# EAGLE design b3 bart - rev00 (EAGLE 9.5.2)
COMPANY: ADAFRUIT INDUSTRIES; DRAWN: KTOWN; REV: B
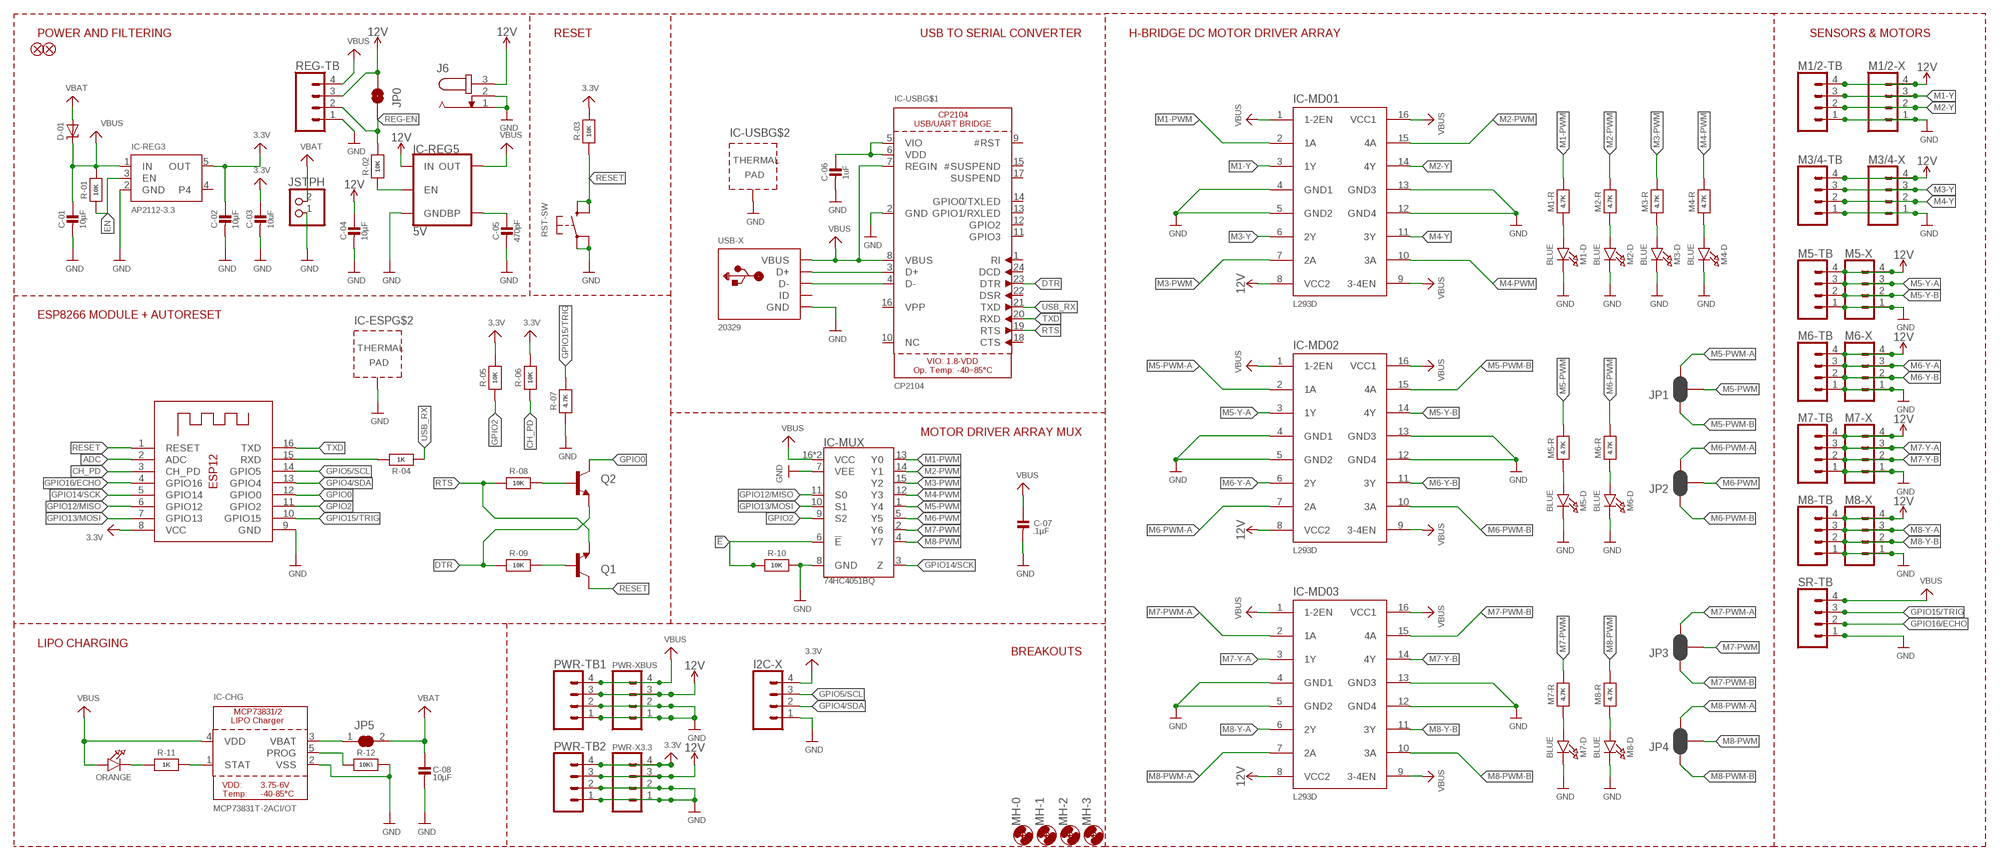
[diagram p0: schematic, sheet 1]

## Parts
C-01  10µF  CAP_CERAMIC0805-NOOUTLINE  [0805-NO]
C-02  10µF  CAP_CERAMIC0805-NOOUTLINE  [0805-NO]
C-03  10uF  CAP_CERAMIC0805-NOOUTLINE  [0805-NO]
C-04  10µF  CAP_CERAMIC0805-NOOUTLINE  [0805-NO]
C-05  470pF  CAP_CERAMIC0805-NOOUTLINE  [0805-NO]
C-06  1uF  CAP_CERAMIC0603_NO  [0603-NO@1]
C-07  .1µF  CAP_CERAMIC0805-NOOUTLINE  [0805-NO]
C-08  10µF  CAP_CERAMIC0805-NOOUTLINE  [0805-NO]
CHG-D  ORANGE  LED0805_NOOUTLINE  [CHIPLED_0805_NOOUTLINE]
D-01  MBR120  DIODE-SCHOTTKYSOD-123  [SOD-123]
FD1  FIDUCIAL1X2  [FIDUCIAL-1X2]
FD2  FIDUCIAL1X2  [FIDUCIAL-1X2]
I2C-X  CONN_04LONGPADS  [1X04_LONGPADS]
IC-CHG  MCP73831T-2ACI/OT  MCP73831/2  [SOT23-5]
IC-ESP  ESP-12  ESP-12S  [ESP-12S]
IC-MD01  L293D  [DIL16]
IC-MD02  L293D  [DIL16]
IC-MD03  L293D  [DIL16]
IC-MUX  74HC4051BQ  [DHVQFN-16-2.5X3.5MM]
IC-REG3  AP2112-3.3  VREG_SOT23-5  [SOT23-5]
IC-REG5  5V  V_REG_MIC52055V  [SOT23-5]
IC-USB  CP2104  [QFN24_4MM_SMSC]
J6  JACK-PLUG1  [SPC4078]
JP0  JUMPER-SMT_2_NO_SILK  [SMT-JUMPER_2_NO_SILK]
JP1  JUMPER-SMT_3_2-NC_PASTE_SILK  [SMT-JUMPER_3_2-NC_PASTE_SILK]
JP2  JUMPER-SMT_3_2-NC_PASTE_SILK  [SMT-JUMPER_3_2-NC_PASTE_SILK]
JP3  JUMPER-SMT_3_2-NC_PASTE_SILK  [SMT-JUMPER_3_2-NC_PASTE_SILK]
JP4  JUMPER-SMT_3_2-NC_PASTE_SILK  [SMT-JUMPER_3_2-NC_PASTE_SILK]
JP5  SOLDERJUMPER_CLOSED  [SOLDERJUMPER_CLOSEDWIRE]
M1-D  BLUE  LED0805_NOOUTLINE  [CHIPLED_0805_NOOUTLINE]
M1-R  4.7K  RESISTOR_0603_NOOUT  [0603-NO]
M1/2-TB  CONN_04SCREW  [SCREWTERMINAL-3.5MM-4]
M1/2-X  CONN_04LONGPADS  [1X04_LONGPADS]
M2-D  BLUE  LED0805_NOOUTLINE  [CHIPLED_0805_NOOUTLINE]
M2-R  4.7K  RESISTOR_0603_NOOUT  [0603-NO]
M3-D  BLUE  LED0805_NOOUTLINE  [CHIPLED_0805_NOOUTLINE]
M3-R  4.7K  RESISTOR_0603_NOOUT  [0603-NO]
M3/4-TB  CONN_04SCREW  [SCREWTERMINAL-3.5MM-4]
M3/4-X  CONN_04LONGPADS  [1X04_LONGPADS]
M4-D  BLUE  LED0805_NOOUTLINE  [CHIPLED_0805_NOOUTLINE]
M4-R  4.7K  RESISTOR_0603_NOOUT  [0603-NO]
M5-D  BLUE  LED0805_NOOUTLINE  [CHIPLED_0805_NOOUTLINE]
M5-R  4.7K  RESISTOR_0603_NOOUT  [0603-NO]
M5-TB  CONN_04SCREW  [SCREWTERMINAL-3.5MM-4]
M5-X  CONN_04LONGPADS  [1X04_LONGPADS]
M6-D  BLUE  LED0805_NOOUTLINE  [CHIPLED_0805_NOOUTLINE]
M6-R  4.7K  RESISTOR_0603_NOOUT  [0603-NO]
M6-TB  CONN_04SCREW  [SCREWTERMINAL-3.5MM-4]
M6-X  CONN_04LONGPADS  [1X04_LONGPADS]
M7-D  BLUE  LED0805_NOOUTLINE  [CHIPLED_0805_NOOUTLINE]
M7-R  4.7K  RESISTOR_0603_NOOUT  [0603-NO]
M7-TB  CONN_04SCREW  [SCREWTERMINAL-3.5MM-4]
M7-X  CONN_04LONGPADS  [1X04_LONGPADS]
M8-D  BLUE  LED0805_NOOUTLINE  [CHIPLED_0805_NOOUTLINE]
M8-R  4.7K  RESISTOR_0603_NOOUT  [0603-NO]
M8-TB  CONN_04SCREW  [SCREWTERMINAL-3.5MM-4]
M8-X  CONN_04LONGPADS  [1X04_LONGPADS]
MH-0  MOUNT-HOLE3.0  [3,0]
MH-1  MOUNT-HOLE3.0  [3,0]
MH-2  MOUNT-HOLE3.0  [3,0]
MH-3  MOUNT-HOLE3.0  [3,0]
PWR-TB1  CONN_04SCREW  [SCREWTERMINAL-3.5MM-4]
PWR-TB2  CONN_04SCREW  [SCREWTERMINAL-3.5MM-4]
PWR-X3.3  CONN_04LONGPADS  [1X04_LONGPADS]
PWR-XBUS  CONN_04LONGPADS  [1X04_LONGPADS]
Q1  mmbt2222  TRANSISTOR_NPNSOT23-3  [SOT23-3]
Q2  mmbt2222  TRANSISTOR_NPNSOT23-3  [SOT23-3]
R-01  10K  RESISTOR_0603_NOOUT  [0603-NO]
R-02  10K  RESISTOR_0603_NOOUT  [0603-NO]
R-03  10K  RESISTOR_0603_NOOUT  [0603-NO]
R-04  1K  RESISTOR_0603MP  [_0603MP]
R-05  10K  RESISTOR_0603_NOOUT  [0603-NO]
R-06  10K  RESISTOR_0603_NOOUT  [0603-NO]
R-07  4.7K  RESISTOR_0603_NOOUT  [0603-NO]
R-08  10K  RESISTOR_0603_NOOUT  [0603-NO]
R-09  10K  RESISTOR_0603_NOOUT  [0603-NO]
R-10  10K  RESISTOR_0603_NOOUT  [0603-NO]
R-11  1K  RESISTOR_0603_NOOUT  [0603-NO]
R-12  10K\  RESISTOR_0603_NOOUT  [0603-NO]
REG-TB  CONN_04SCREW  [SCREWTERMINAL-3.5MM-4]
RST-SW  KMR2  SWITCH_TACT_SMT4.6X2.8  [BTN_KMR2_4.6X2.8]
SR-TB  CONN_04SCREW  [SCREWTERMINAL-3.5MM-4]
USB-X  20329  USB_MICRO_20329_V2  [4UCONN_20329_V2]
X1  JSTPH  CON_JST_PH_2PIN  [JSTPH2]

## Nets
3.3V: C-02.1 C-03.1 I2C-X.4 IC-ESP.8(VCC) IC-REG3.5(OUT) PWR-TB2.4 PWR-X3.3.4 R-03.2 R-05.2 R-06.2
12V [power-motors]: C-04.1 IC-MD01.8(VCC2) IC-MD02.8(VCC2) IC-MD03.8(VCC2) IC-REG5.1(IN) J6.3 JP0.2 M1/2-TB.4 M1/2-X.4 M3/4-TB.4 M3/4-X.4 M5-TB.4 M5-X.4 M6-TB.4 M6-X.4 M7-TB.4 M7-X.4 M8-TB.4 M8-X.4 PWR-TB1.3 PWR-TB2.3 PWR-X3.3.3 PWR-XBUS.3 REG-TB.3
!E!: IC-MUX.6(!E!) R-10.1
ADC: IC-ESP.2(ADC)
CH_PD: IC-ESP.3(CH_PD) R-06.1
D+: IC-USB.3(D+) USB-X.D+
D-: IC-USB.4(D-) USB-X.D-
DTR: IC-USB.23(DTR) Q2.2(E) R-09.1
EN: IC-REG3.3(EN) R-01.1
GND: C-01.2 C-02.2 C-03.2 C-04.2 C-05.2 C-06.2 C-07.2 C-08.2 I2C-X.1 IC-CHG.2(VSS) IC-ESP.9(GND) IC-ESP.P$1(TP) IC-MD01.4(GND1) IC-MD01.5(GND2) IC-MD01.12(GND4) IC-MD01.13(GND3) IC-MD02.4(GND1) IC-MD02.5(GND2) IC-MD02.12(GND4) IC-MD02.13(GND3) IC-MD03.4(GND1) IC-MD03.5(GND2) IC-MD03.12(GND4) IC-MD03.13(GND3) IC-MUX.7(VEE) IC-MUX.8(GND) IC-REG3.2(GND) IC-REG5.2(GND) IC-USB.2(GND) IC-USB.THERM(TP) J6.1 J6.2 M1-D.C M1/2-TB.1 M1/2-X.1 M2-D.C M3-D.C M3/4-TB.1 M3/4-X.1 M4-D.C M5-D.C M5-TB.1 M5-X.1 M6-D.C M6-TB.1 M6-X.1 M7-D.C M7-TB.1 M7-X.1 M8-D.C M8-TB.1 M8-X.1 PWR-TB1.1 PWR-TB1.2 PWR-TB2.1 PWR-TB2.2 PWR-X3.3.1 PWR-X3.3.2 PWR-XBUS.1 PWR-XBUS.2 R-07.1 R-10.2 R-12.2 REG-TB.1 RST-SW.A'(P1) RST-SW.A(P) SR-TB.1 USB-X.BASE@1(GND) USB-X.BASE@2(GND) USB-X.GND USB-X.SPRT@1(GND) USB-X.SPRT@2(GND) USB-X.SPRT@3(GND) USB-X.SPRT@4(GND) X1.1
GPIO0: IC-ESP.12(GPIO0) Q2.3(C)
GPIO2: IC-ESP.11(GPIO2) IC-MUX.9(S2) R-05.1
GPIO4/SDA: I2C-X.2 IC-ESP.13(GPIO4)
GPIO5/SCL: I2C-X.3 IC-ESP.14(GPIO5)
GPIO12/MISO: IC-ESP.6(GPIO12) IC-MUX.11(S0)
GPIO13/MOSI: IC-ESP.7(GPIO13) IC-MUX.10(S1)
GPIO14/SCK: IC-ESP.5(GPIO14) IC-MUX.3(Z)
GPIO15/TRIG: IC-ESP.10(GPIO15) R-07.2 SR-TB.3
GPIO16/ECHO: IC-ESP.4(GPIO16) SR-TB.2
M1-PWM: IC-MD01.2(1A) IC-MUX.13(Y0) M1-R.2
M1-Y [power-motors]: IC-MD01.3(1Y) M1/2-TB.3 M1/2-X.3
M2-PWM: IC-MD01.15(4A) IC-MUX.14(Y1) M2-R.2
M2-Y [power-motors]: IC-MD01.14(4Y) M1/2-TB.2 M1/2-X.2
M3-PWM: IC-MD01.7(2A) IC-MUX.15(Y2) M3-R.2
M3-Y [power-motors]: IC-MD01.6(2Y) M3/4-TB.3 M3/4-X.3
M4-PWM: IC-MD01.10(3A) IC-MUX.12(Y3) M4-R.2
M4-Y [power-motors]: IC-MD01.11(3Y) M3/4-TB.2 M3/4-X.2
M5-PWM: IC-MUX.1(Y4) JP1.2 M5-R.2
M5-PWM-A: IC-MD02.2(1A) JP1.3
M5-PWM-B: IC-MD02.15(4A) JP1.1
M5-Y-A [power-motors]: IC-MD02.3(1Y) M5-TB.3 M5-X.3
M5-Y-B [power-motors]: IC-MD02.14(4Y) M5-TB.2 M5-X.2
M6-PWM: IC-MUX.5(Y5) JP2.2 M6-R.2
M6-PWM-A: IC-MD02.7(2A) JP2.3
M6-PWM-B: IC-MD02.10(3A) JP2.1
M6-Y-A: IC-MD02.6(2Y) M6-TB.3 M6-X.3
M6-Y-B: IC-MD02.11(3Y) M6-TB.2 M6-X.2
M7-PWM: IC-MUX.2(Y6) JP3.2 M7-R.2
M7-PWM-A: IC-MD03.2(1A) JP3.3
M7-PWM-B: IC-MD03.15(4A) JP3.1
M7-Y-A: IC-MD03.3(1Y) M7-TB.3 M7-X.3
M7-Y-B: IC-MD03.14(4Y) M7-TB.2 M7-X.2
M8-PWM: IC-MUX.4(Y7) JP4.2 M8-R.2
M8-PWM-A: IC-MD03.7(2A) JP4.3
M8-PWM-B: IC-MD03.10(3A) JP4.1
M8-Y-A [power-motors]: IC-MD03.6(2Y) M8-TB.3 M8-X.3
M8-Y-B [power-motors]: IC-MD03.11(3Y) M8-TB.2 M8-X.2
N$1: CHG-D.C R-11.1
N$2: M5-D.A M5-R.1
N$3: IC-CHG.1(STAT) R-11.2
N$4: IC-CHG.5(PROG) R-12.1
N$5: M6-D.A M6-R.1
N$6: M1-D.A M1-R.1
N$7: IC-CHG.3(VBAT) JP5.1
N$8: C-06.1 IC-USB.5(VIO) IC-USB.6(VDD)
N$9: M2-D.A M2-R.1
N$10: IC-REG5.3(EN) R-02.1
N$11: M7-D.A M7-R.1
N$12: Q1.1(B) R-09.2
N$13: Q2.1(B) R-08.2
N$15: M8-D.A M8-R.1
N$18: M3-D.A M3-R.1
N$19: M4-D.A M4-R.1
N$21: C-05.1 IC-REG5.4(BP)
REG-EN: JP0.1 R-02.2 REG-TB.2
RESET: IC-ESP.1(RESET) Q1.3(C) R-03.1 RST-SW.B'(S1) RST-SW.B(S)
RTS: IC-USB.19(RTS) Q1.2(E) R-08.1
RXD: IC-ESP.15(RXD) R-04.2
TXD: IC-ESP.16(TXD) IC-USB.20(RXD)
USB_RX: IC-USB.21(TXD) R-04.1
VBAT: C-08.1 D-01.A JP5.2 X1.2
VBUS: C-01.1 C-07.1 CHG-D.A D-01.C IC-CHG.4(VDD) IC-MD01.1(1-2EN) IC-MD01.9(3-4EN) IC-MD01.16(VCC1) IC-MD02.1(1-2EN) IC-MD02.9(3-4EN) IC-MD02.16(VCC1) IC-MD03.1(1-2EN) IC-MD03.9(3-4EN) IC-MD03.16(VCC1) IC-MUX.16(VCC) IC-MUX.EP(VCC) IC-REG3.1(IN) IC-REG5.5(OUT) IC-USB.7(REGIN) IC-USB.8(VBUS) PWR-TB1.4 PWR-XBUS.4 R-01.2 REG-TB.4 SR-TB.4 USB-X.VBUS
Unconnected: IC-REG3.4 IC-USB.1(RI) IC-USB.9(#RST) IC-USB.10(NC) IC-USB.11(GPIO3) IC-USB.12(GPIO2) IC-USB.13(GPIO1/RXLED) IC-USB.14(GPIO0/TXLED) IC-USB.15(#SUSPEND) IC-USB.16(VPP) IC-USB.17(SUSPEND) IC-USB.18(CTS) IC-USB.22(DSR) IC-USB.24(DCD) USB-X.ID

## Notes on the sheet
- POWER AND FILTERING | RESET | USB TO SERIAL CONVERTER | H-BRIDGE DC MOTOR DRIVER ARRAY | SENSORS & MOTORS
- ESP8266 MODULE + AUTORESET
- MOTOR DRIVER ARRAY MUX
- LIPO CHARGING | BREAKOUTS

## Library data of the parts
C-01-C-08 = microbuilder:CAP_CERAMIC: Ceramic Capacitors For new designs, use the packages preceded by an '_' character since they are more reliable: The following footprints should be used on most boards: _0402 - Standard footprint for regular board layouts _0603 - Standard footprint for regular board layouts _0805 - Standard footprint for regular board layouts _1206 - Standard footprint for regular board layouts For extremely tight-pitch boards where space is at a premium, the following 'micro-pitch' footprints can be used (smaller pads, no silkscreen outline, etc.): _0402MP - Micro-pitch footprint for very dense/compact boards _0603MP - Micro-pitch footprint for very dense/compact boards _0805MP - Micro-pitch footprint for very dense/compact boards _1206MP - Micro-pitch footprint for very dense/compact boards
CHG-D M1-D M2-D M3-D M4-D M5-D M6-D M7-D M8-D = microbuilder:LED: LED 0603 - 0603 Surface Mount Package 2mA: Green LED - Low Power (3.9mcd, 2ma, 1.7Vf) - Digikey: 475-2709-2-ND Orange LED - Low Power (9.8mcd, 2ma, 1.8Vf) - Digikey: 475-1194-2-ND Red LED - Low Power (5mcd, 2ma, 1.8Vf) - Digikey: 475-1195-2-ND Yellow LED - Low Power (7mcd, 2ma, 1.8Vf) - Digikey: 475-1196-2-ND 5mA: Blue LED - Low Power (17mcd, 5ma, 2.9Vf) - Digikey: LNJ937W8CRACT-ND 0805 - 0805 Surface Mount Package 2mA: Red LED (8.8mcd, 2mA, 1.8Vf, Clear) - Low Power [Digikey: 475-2510-1-ND] Green LED (5mcd, 2mA, 1.8Vf, Clear) - Low Power [Digikey: 475-2730-1-ND] Yellow LED (11.3mcd, 2mA, 1.8Vf, Clear) - Low Power [Digikey: 475-2555-1-ND] 20mA: Red LED (104mcd, 20mA, Diffused) - LS R976 [Digikey: 475-1278-6-ND] Red LED (12mcd, 20mA, 2.0Vf, Clear) - APT2012EC [Digikey: 754-1128-1-ND] Green LED (15mcd, 20mA, 2.2Vf, Clear) - APT2012GC [Digikey: 754-1131-1-ND] Orange LED (160mcd, 20mA, 2.1Vf, Clear) - APT2012SECK [Digikey: 754-1130-1-ND] 1206 - 1206 Surface Mount Package Green LED (26mcd, 20mA, Diffused) - LG N971 [Digikey: 475-1407-6-ND] Red LED (15mcd, 20mA, Diffused) - LH N974 [Digikey: 475-1416-6-ND] Cree - Cree High-Power Surface Mount LEDs XPEBWT-L1-0000-00D50 - White 111lm 350mA 2.9Vf 6200K 110° XTEAWT-00-0000-00000LEE3 - White 114lm 350mA 2.85Vf 5000K 115° Everlight - Everlight 45-21 Series Surface Mount LEDs 45-21/QK2C-B2832AC2CB2/2T - Warm White 2000mcd 20mA 3.25Vf 3050K 120° 45-21/LK2C-B38452C4CB2/2T - Nuetral White 2000mcd 20mA 3.25Vf 4150K 120° 45-21/LK2C-B50634C6CB2/2T - Cold White 2200mcd 20mA 3.25Vf 5650K 120° PLCC2 Reverse Mount LS T77K-J1L2-1-0-2-R18-Z - Red 11.25mcd 2mA 1.8Vf 630nm 120° LO T77K-L1M2-24-Z - Orange 19.6mcd 2mA 1.8Vf 606nm 120° LY T77K-K2M1-26-Z - Yellow 15.7mcd 2mA 1.8Vf 587nm 120°
D-01 = microbuilder:DIODE-SCHOTTKY
FD1 FD2 = SparkFun-Aesthetics:FIDUCIAL: Fiducial Alignment Points Point-of-reference for pick-and-place machines and other optical instruments.
I2C-X M1/2-X M3/4-X M5-X M6-X M7-X M8-X PWR-X3.3 PWR-XBUS = SparkFun-Connectors:CONN_04: Multi connection point. Often used as Generic Header-pin footprint for 0.1 inch spaced/style header connections On any of the 0.1 inch spaced packages, you can populate with these: Break Away Headers - Straight <https://www.sparkfun.com/products/116> (PRT-00116) Break Away Male Headers - Right Angle <https://www.sparkfun.com/products/553> (PRT-00553) Female Headers <https://www.sparkfun.com/products/115> (PRT-00115) Break Away Headers - Machine Pin <https://www.sparkfun.com/products/117> (PRT-00117) Break Away Female Headers - Swiss Machine Pin <https://www.sparkfun.com/products/743> (PRT-00743) For SCREWTERMINALS and SPRING TERMINALS visit here: Screw Terimnals on SparkFun.com <https://www.sparkfun.com/search/results?term=Screw+Terminals> (5mm/3.5mm/2.54mm spacing) This device is also useful as a general connection point to wire up your design to another part of your project. Our various solder wires solder well into these plated through hole pads. Hook-Up Wire - Assortment (Stranded, 22 AWG) <https://www.sparkfun.com/products/11375> (PRT-11375) Hook-Up Wire - Assortment (Solid Core, 22 AWG) <https://www.sparkfun.com/products/11367> (PRT-11367) View the entire wire category on our website here <https://www.sparkfun.com/categories/141> Special notes: Molex polarized connector foot print use with SKU : PRT-08231 with associated crimp pins and housings. 1MM SMD Version SKU: PRT-10208; PROD_ID: CONN-09696
IC-CHG = microbuilder:MCP73831/2: MCP73831/2 LIPO Charger VDD: 3.75 - 6V Temp -40 - 85°C Programmable Charge Rate: 15-500mA NOTE: STAT is a tri-state logic output on the MCP73831 and an open-drain output on the MCP73832. SOT23-5 with 4.2V output and tri-state logic on STAT = MCP73831T-2ACI/OT
IC-ESP = microbuilder:ESP-12S
IC-MD01-IC-MD03 = st-microelectronics:L293D: PUSH-PULL 4 CHANNEL DRIVER; MPN: L293D; OC_FARNELL: 9589619; OC_NEWARK: 56P8249
IC-MUX = 8mux:74HC4051: NXP 74HC4051 8-Channel Analog Multiplexer/Demultiplexer The 74HC4051; 74HCT4051 is a single-pole octal-throw analog switch (SP8T) suitable for use in analog or digital 8:1 multiplexer/demultiplexer applications. The switch features three digital select inputs (S0, S1 and S2), eight independent inputs/outputs (Yn), a common input/output (Z) and a digital enable input (E). When E is HIGH, the switches are turned off. Inputs include clamp diodes. This enables the use of current limiting resistors to interface inputs to voltages in excess of VCC. Datasheet <http://www.nxp.com/documents/data_sheet/74HC_HCT4051.pdf>; PROD_ID: IC-13334
IC-REG3 = microbuilder:VREG_SOT23-5: SOT23-5 Fixed Voltage Regulators Part Current Out V Out V In V Dropout θJA (°C/W) TJ (°C) Digikey Part No. ADP121 150mA 3.3V 3.4-5.5V 0.09V @ 150mA -- -- ADP121-AUJZ33R7CT-ND ADP121 150mA 3.0V 3.1-5.5V 0.09V @ 150mA -- -- ADP121-AUJZ30R7CT-ND ADP122 300mA 3.3V 3.4-5.5V 0.085V @ 300mA -- -- ADP122AUJZ-3.3-R7CT-ND ADP1712 300mA 3.3V 3.5-5.5V 0.17V @ 300mA -- -- ADP1712AUJZ-3.3-R7TR-ND AP7311 (Low Cost) 150mA 3.3V 3.5-6V 0.15V @ 150mA -- -- AP7311-33WG-7DICT-ND LD39015M18R 150mA 1.8V 1.9V-5.5V 0.08V @ 100mA -- -- 497-6977-1-ND LP2985A-33DBVR 150mA 3.3V 3.3-16V 0.28V @ 150mA 206 150 296-18479-1-ND MCP1824T-3302E/OT 300mA 3.3V 3.5V-6V 0.2V @ 300mA -- -- MCP1824T-3302E/OTCT-ND MIC5205-2.5YM5 TR 150mA 2.5V 2.7-16V 0.165V @ 150mA -- -- 576-1257-2-ND MIC5205-3.0YM5 TR 150mA 3.0V 3.2V-16V 0.165V @ 150mA -- -- 576-1258-2-ND MIC5205-3.3YM5 TR 150mA 3.3V 3.5V-16V 0.165V @ 150mA -- -- 576-1259-2-ND TPS780330220 150mA 3.3V+2.2V 3.6-5.5V 250mV Max -- -- 296-23332-1-ND TDA3663/N1,135 100mA 3.3V 3.5-45V 0.18V @ 50mA -- -- 568-5343-1-ND Max operating temp can be calculated using θJA, TJ (max junction temperature), and power in watts. Set the "Maximum Ambient Temperature" until it reaches TJ ("Max Junction Temperature"), which is the absolute limit for safe use of the regulator: Heat Sink Temperature Calculator <http://www.daycounter.com/Calculators/Heat-Sink-Temperature-Calculator.phtml> For example, With 12V source into a 3.3V LP2985 and a 30mA load, we are dissipating (12V-3.3V) * 0.03A = 0.261W. With a θJA of 206 °C/W, a TJ of 150°C, and 261mW we can safely use the chip without a heat sink up to 75°C (=147.1°C Junction Temperature).
IC-REG5 = SparkFun-IC-Power:V_REG_MIC5205: V_REG MIC5205 Standard 3.3V, 5V, and Adjustable 150mA LDO voltage regulator in SOT-23 layout. Micrel part MIC5205. BP (by-pass) pin is used to lower output noise with 470pF cap, may be left open. On the adjustable version BP is used to set output.; PROD_ID: VREG-00823
IC-USB = microbuilder:CP2104: CP2104 - USB to UART Bridge VDD Output: 3.45V
J6 = con-jack:JACK-PLUG: DC POWER JACK Power Jack, DC, Right Angle, Through Hole, Rated 5A at 16VDC, PC Terminals Distributor: Farnell (www.Farnell.de) Drawing: 84N1161.pdf / 84N1162.pdf Manufacturer: SPC Technology (www.spctechnology.com) Type: SPC4077 / SPC 4078; OC_FARNELL: unknown; OC_NEWARK: unknown
JP0 = SparkFun-Jumpers:JUMPER-SMT_2_NO: Normally open jumper This jumper has two pads in close proximity to each other. Apply solder to close the connection. Round pads are easier to solder for beginners, but are a lot larger. SparkFun Product that uses the round pads: SparkFun EL Sequencer <https://www.sparkfun.com/products/12781>
JP1-JP4 = SparkFun-Jumpers:JUMPER-SMT_3_2-NC_PASTE: Normally closed solder jumper (2 of 2 connections) This jumper has an aperture in the stencil to allow solder paste to bridge both connections. Both connections are normally closed (NC). Wick off the solder to open the connection(s). Reapply solder to reclose the connection(s).
JP5 = microbuilder:SOLDERJUMPER_CLOSED: Solder Jumper - Closed These solder jumpers are closed by default CLOSEDWIRE - 10 mil trace between pads that can be cut and resoldered later CLOSEDPERM - 63 mil trace between pads for a permanent connection (used to 'bridge' two signals, a shameless hack for Eagle). Can double as a test point as well (no cream layer)
M1-R M2-R M3-R M4-R M5-R M6-R M7-R M8-R R-01-R-09 R-10-R-12 = microbuilder:RESISTOR: Resistors For new designs, use the packages preceded by an '_' character since they are more reliable: The following footprints should be used on most boards: _0402 - Standard footprint for regular board layouts _0603 - Standard footprint for regular board layouts _0805 - Standard footprint for regular board layouts _1206 - Standard footprint for regular board layouts For extremely tight-pitch boards where space is at a premium, the following 'micro-pitch' footprints can be used (smaller pads, no silkscreen outline, etc.): _0402MP - Micro-pitch footprint for very dense/compact boards _0603MP - Micro-pitch footprint for very dense/compact boards _0805MP - Micro-pitch footprint for very dense/compact boards _1206MP - Micro-pitch footprint for very dense/compact boards
M1/2-TB M3/4-TB M5-TB M6-TB M7-TB M8-TB PWR-TB1 PWR-TB2 REG-TB SR-TB = SparkFun-Connectors:CONN_04: Multi connection point. Often used as Generic Header-pin footprint for 0.1 inch spaced/style header connections On any of the 0.1 inch spaced packages, you can populate with these: Break Away Headers - Straight <https://www.sparkfun.com/products/116> (PRT-00116) Break Away Male Headers - Right Angle <https://www.sparkfun.com/products/553> (PRT-00553) Female Headers <https://www.sparkfun.com/products/115> (PRT-00115) Break Away Headers - Machine Pin <https://www.sparkfun.com/products/117> (PRT-00117) Break Away Female Headers - Swiss Machine Pin <https://www.sparkfun.com/products/743> (PRT-00743) For SCREWTERMINALS and SPRING TERMINALS visit here: Screw Terimnals on SparkFun.com <https://www.sparkfun.com/search/results?term=Screw+Terminals> (5mm/3.5mm/2.54mm spacing) This device is also useful as a general connection point to wire up your design to another part of your project. Our various solder wires solder well into these plated through hole pads. Hook-Up Wire - Assortment (Stranded, 22 AWG) <https://www.sparkfun.com/products/11375> (PRT-11375) Hook-Up Wire - Assortment (Solid Core, 22 AWG) <https://www.sparkfun.com/products/11367> (PRT-11367) View the entire wire category on our website here <https://www.sparkfun.com/categories/141> Special notes: Molex polarized connector foot print use with SKU : PRT-08231 with associated crimp pins and housings. 1MM SMD Version SKU: PRT-10208; PROD_ID: 2xCONN-08399; SF_ID: 2xPRT-08084
MH-0 MH-1-MH-3 = holes:MOUNT-HOLE: MOUNTING HOLE with drill center marker
Q1 Q2 = SparkFun:TRANSISTOR_NPN: Transistor NPN BJT configuration in SOT23 package. MMBT2222 is the common NPN we use. Double check BCE configuration again layout.
RST-SW = microbuilder:SWITCH_TACT_SMT: SMT Tact Switches 6x6mm - Digikey: P12940SCT-ND KMR2 (4.6x2.8mm) - Digikey: 401-1426-1-ND EVQ-PQHB55 - Light Touch, 160GF (4.5x4.5mm) - Digikey: P8090SCT-ND KMT0 - KMT021 NGJ LHS (etc.) IP68/Waterproof - Digikey: CKN10289CT-ND
USB-X = microbuilder:USB: USB Connectors USBMINIB - Surface Mount Female Mini-B USB Connector 4UConnector: 06564
X1 = microbuilder:CON_JST_PH_2PIN: JST 2-Pin Right-Angle Connector PH-Series - 4UConnector: 17311 SH-Series - 4UConnector: 07278

## Net classes
0 default: width 0.254 mm, drill 0.406 mm, clearance 0.203 mm
2 power-motors: width 0.457 mm, drill 0.406 mm, clearance 0.305 mm

## Board
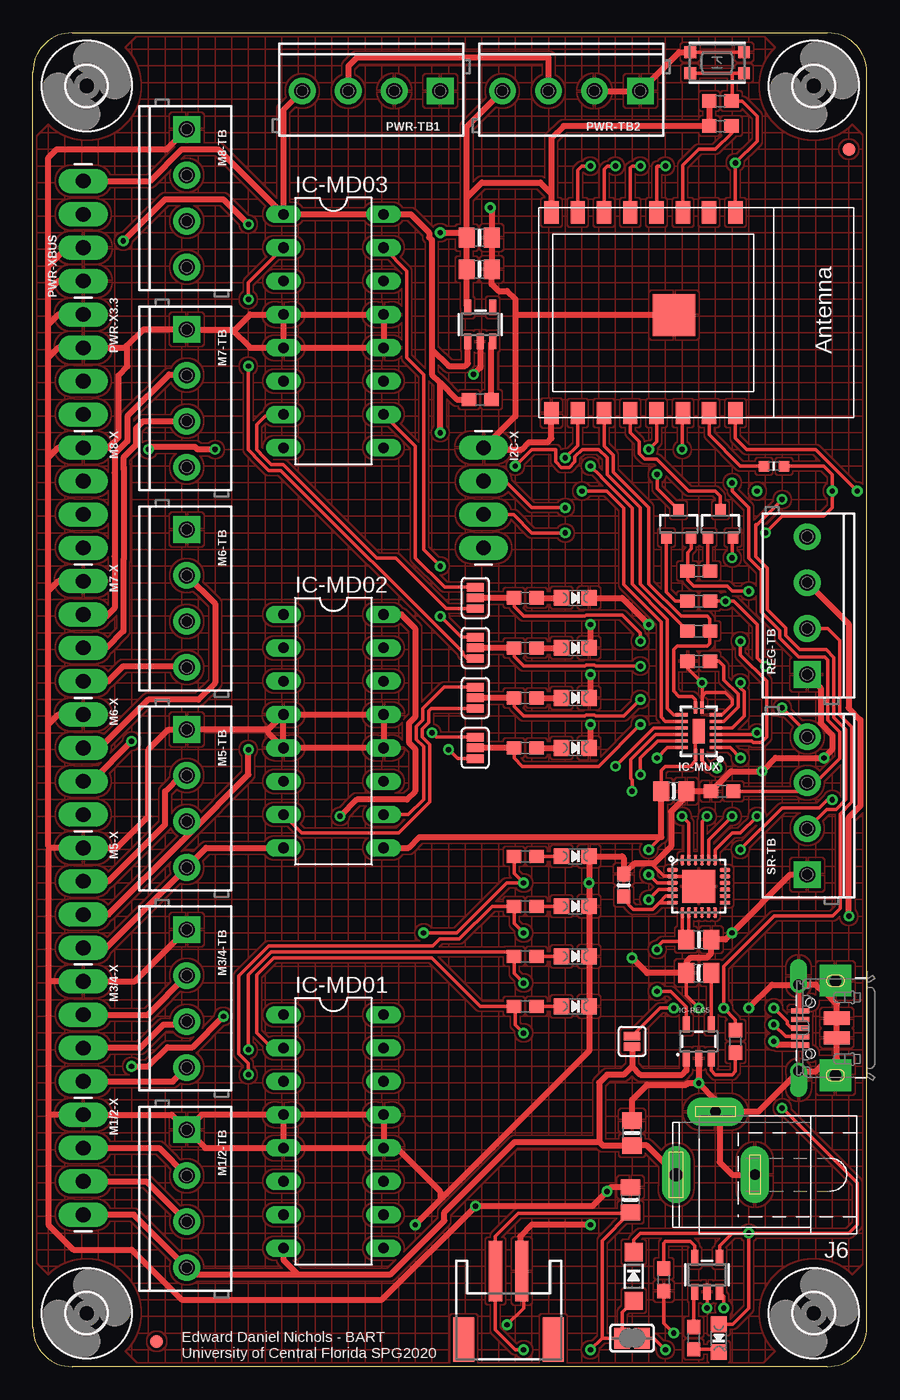
[diagram p1: board, top side]
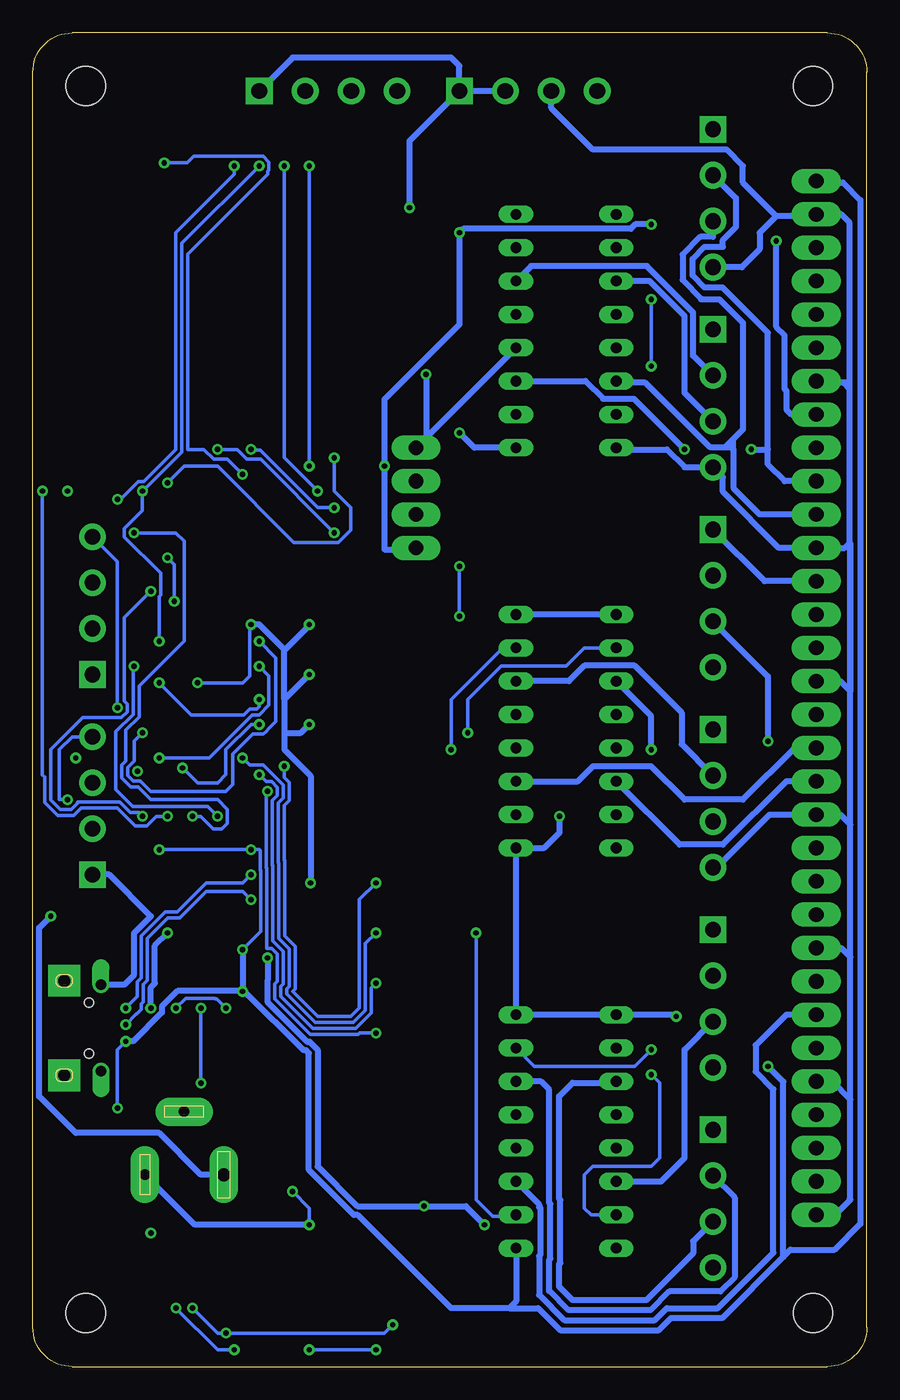
[diagram p2: board, bottom side, seen from below]

Size 63.5 x 101.6 mm. Coordinates in mm from the lower left corner, seen from the top.
Outline: 60.5,0 3,0 arc-90 0,3 0,98.6 arc-90 3,101.6 60.5,101.6 arc-90 63.5,98.6 63.5,3 arc-90 60.5,0
Copper layers (1*16): Top 0.035mm / dielectric 1.5mm / Bottom 0.035mm
Design rules "adafruit *": minimum track width 8mil, minimum drill 15.5mil, track to track 8mil, track to pad 8mil, pad to pad 8mil, via to via 8mil, smd to smd 8mil, copper to edge 10mil, drill to drill 8mil, minimum pad ring 10mil, minimum via ring 8mil, stop-mask expansion 2mil, vias tented up to drill 20mil, thermal gap 10mil
tKeepout: area 54.5,70.5 to 63.4,90.2

### Footprints (pad centres in the part's own frame; a part is rotated, then mirrored left to right if it is on the bottom)
0805-NO = smd 1.24 x 1.5: 1 -0.95,0; 2 0.95,0
0603-NO@1 = smd 1.075 x 1: 1 -0.85,0; 2 0.85,0
CHIPLED_0805_NOOUTLINE = smd 1.2 x 1.2: A 0,-1.05; C 0,1.05
SOD-123 = smd 1.4 x 1.4: A 1.85,0; C -1.85,0
FIDUCIAL-1X2 = smd 1 x 1: 1 0,0
1X04_LONGPADS = drill 1.118 pad 1.88 long: 1 0,0; 2 2.54,0; 3 5.08,0; 4 7.62,0
SOT23-5 = smd 0.55 x 1.2: 1 -0.95,-1.3; 2 0,-1.3; 3 0.95,-1.3; 4 0.95,1.3; 5 -0.95,1.3
ESP-12S = smd 1.7 x 1.1: 1 -7.65,5.77; 2 -7.65,3.77; 3 -7.65,1.77; 4 -7.65,-0.23; 5 -7.65,-2.23; 6 -7.65,-4.23; 7 -7.65,-6.23; 8 -7.65,-8.23; 9 7.65,-8.23; 10 7.65,-6.23; 11 7.65,-4.23; 12 7.65,-2.23; 13 7.65,-0.23; 14 7.65,1.77; 15 7.65,3.77; 16 7.65,5.77 | smd 3.2 x 3.2: P$1 0.2,1.1
DIL16 = drill 0.813 long: 1 -8.89,-3.81; 2 -6.35,-3.81; 3 -3.81,-3.81; 4 -1.27,-3.81; 5 1.27,-3.81; 6 3.81,-3.81; 7 6.35,-3.81; 8 8.89,-3.81; 9 8.89,3.81; 10 6.35,3.81; 11 3.81,3.81; 12 1.27,3.81; 13 -1.27,3.81; 14 -3.81,3.81; 15 -6.35,3.81; 16 -8.89,3.81
DHVQFN-16-2.5X3.5MM = smd 0.9 x 0.24: 1 -1.8,-0.25; 8 1.8,-0.25; 9 1.8,0.25; 16 -1.8,0.25 | smd 0.24 x 0.9: 2 -1.25,-1.3; 3 -0.75,-1.3; 4 -0.25,-1.3; 5 0.25,-1.3; 6 0.75,-1.3; 7 1.25,-1.3; 10 1.25,1.3; 11 0.75,1.3; 12 0.25,1.3; 13 -0.25,1.3; 14 -0.75,1.3; 15 -1.25,1.3 | smd 1.9 x 0.9: EP 0,0
QFN24_4MM_SMSC = smd 0.8 x 0.28: 1 -2,1.25; 2 -2,0.75; 3 -2,0.25; 4 -2,-0.25; 5 -2,-0.75; 6 -2,-1.25; 13 2,-1.25; 14 2,-0.75; 15 2,-0.25; 16 2,0.25; 17 2,0.75; 18 2,1.25 | smd 0.28 x 0.8: 7 -1.25,-2; 8 -0.75,-2; 9 -0.25,-2; 10 0.25,-2; 11 0.75,-2; 12 1.25,-2; 19 1.25,2; 20 0.75,2; 21 0.25,2; 22 -0.25,2; 23 -0.75,2; 24 -1.25,2 | smd 2.5 x 2.5: THERM 0,0
SPC4078 = drill 0.8 pad 2.184 long: 1 -3,0; 2 0,-4.8 | drill 1 pad 2.184 long: 3 3,0
SMT-JUMPER_2_NO_SILK = smd 0.635 x 1.27: 1 -0.406,0; 2 0.406,0
SMT-JUMPER_3_2-NC_PASTE_SILK = smd 0.635 x 1.27: 1 -0.813,0; 2 0,0; 3 0.813,0
SOLDERJUMPER_CLOSEDWIRE = smd 1.168 x 1.6: 1 -0.762,0; 2 0.762,0 | smd 0.635 x 0.203: WIRE 0,0
0603-NO = smd 1.1 x 1: 1 -0.85,0; 2 0.85,0
SCREWTERMINAL-3.5MM-4 = drill 1.2 pad 2.032 square: 1 0,0 | drill 1.2 pad 2.032: 2 3.5,0; 3 7,0; 4 10.5,0
3,0 = hole 3: 0,0
SOT23-3 = smd 0.8 x 0.9: 1 -0.95,-1; 2 0.95,-1; 3 0,1.1
_0603MP = smd 0.8 x 0.8: 1 -0.762,0; 2 0.762,0
BTN_KMR2_4.6X2.8 = smd 0.9 x 0.9: A 2.05,0.8; A' -2.05,0.8; B 2.05,-0.8; B' -2.05,-0.8
4UCONN_20329_V2 = smd 1 x 2: BASE@1 -0.75,-2; BASE@2 0.75,-2 | smd 0.4 x 1.35: D+ 0,0.775; D- -0.65,0.775; GND 1.3,0.775; ID 0.65,0.775; VBUS -1.3,0.775 | drill 0.8 pad 1.143 offset: SPRT@1 -3.3,0.9; SPRT@2 3.3,0.9 | drill 0.9 pad 2.413 square: SPRT@3 -3.6,-1.9; SPRT@4 3.6,-1.9 | hole 0.7: -1.95,0; 1.95,0
JSTPH2 = smd 1 x 4.6: 1 -1,-3.7; 2 1,-3.7 | smd 1.6 x 3.4: NC1 -3.4,1.5; NC2 3.4,1.5

### Placement (x,y rotation side)
C-01  50.7,32.53 0 top
C-02  33.99,83.58 0 top
C-03  33.99,85.99 0 top
C-04  45.62,17.8 90 top
C-05  50.7,29.99 180 top
C-06  44.99,36.67 90 top
C-07  48.8,43.83 0 top
C-08  45.5,12.72 90 top
CHG-D  52.23,2.17 180 top
D-01  45.75,6.87 270 top
FD1  62.13,92.73 0 top
FD2  9.43,1.92 0 top
I2C-X  34.32,69.99 270 top
IC-CHG  51.34,7 0 top
IC-ESP  47.72,80.28 270 top
IC-MD01  22.89,17.92 270 top
IC-MD02  22.89,48.4 270 top
IC-MD03  22.89,78.88 270 top
IC-MUX  50.7,48.4 90 top
IC-REG3  34.07,79.39 0 top
IC-REG5  50.7,24.78 0 top
IC-USB  50.7,36.59 0 top
J6  51.98,14.62 180 top
JP0  45.62,24.78 270 top
JP1  33.69,47.13 90 top
JP2  33.69,50.94 270 top
JP3  33.69,54.75 270 top
JP4  33.69,58.56 270 top
JP5  45.62,2.17 180 top
M1-D  41.31,27.45 270 top
M1-R  37.5,27.45 180 top
M1/2-TB  11.72,18.05 270 top
M1/2-X  3.84,19.19 270 top
M2-D  41.31,31.26 270 top
M2-R  37.5,31.26 180 top
M3-D  41.31,35.07 270 top
M3-R  37.5,35.07 180 top
M3/4-TB  11.72,33.29 270 top
M3/4-X  3.84,29.35 270 top
M4-D  41.31,38.88 270 top
M4-R  37.5,38.88 180 top
M5-D  41.31,47.13 270 top
M5-R  37.5,47.13 180 top
M5-TB  11.72,48.53 270 top
M5-X  3.84,39.51 270 top
M6-D  41.31,50.94 270 top
M6-R  37.5,50.94 180 top
M6-TB  11.72,63.77 270 top
M6-X  3.84,49.67 270 top
M7-D  41.31,54.75 270 top
M7-R  37.5,54.75 180 top
M7-TB  11.72,79.01 270 top
M7-X  3.84,59.83 270 top
M8-D  41.31,58.56 270 top
M8-R  37.5,58.56 180 top
M8-TB  11.72,94.25 270 top
M8-X  3.84,69.99 270 top
MH-0  4.1,97.55 0 top
MH-1  59.47,4.08 0 top
MH-2  4.1,4.08 0 top
MH-3  59.47,97.55 0 top
PWR-TB1  31.02,97.17 180 top
PWR-TB2  46.26,97.17 180 top
PWR-X3.3  3.84,80.15 270 top
PWR-XBUS  3.84,82.69 90 top
Q1  49.18,64.15 0 top
Q2  52.36,64.15 0 top
R-01  34.07,73.68 180 top
R-02  53.5,24.78 90 top
R-03  52.36,96.41 180 top
R-04  56.42,68.6 180 top
R-05  50.7,56.02 180 top
R-06  52.36,94.5 180 top
R-07  52.48,43.83 0 top
R-08  50.7,60.59 0 top
R-09  50.7,58.31 180 top
R-10  50.7,53.74 180 top
R-11  50.32,2.17 90 top
R-12  48.04,6.62 270 top
REG-TB  58.96,52.72 90 top
RST-SW  52.1,99.33 0 top
SR-TB  58.96,37.48 90 top
USB-X  59.21,25.8 90 top
X1  36.23,3.57 180 top

### Tracks (layer width: path | path; a pad name or v marks a point on that pad's centre or on a via)
3.3V  (via drill 0.41)
  Top 0.254: R-05.2 46.26,59.62 46.26,65.42 43.72,67.96 43.72,69.23 43.09,69.87 41.83,69.87 41.28,69.32 41.28,68.93 40.85,68.49 40.24,68.49 39.81,68.93 39.81,69.87 38.01,69.87 v36.73,68.6
  Top 0.457: IC-REG3.5 33.04,80.77 C-02.1 C-03.1 | C-03.1 33.04,89.03 | 33.04,89.03 34.2,90.19 38.64,90.19 39.49,89.34 | 39.49,89.34 IC-ESP.8 | v6.89,85.74 10.06,88.92 14.51,88.92 v16.42,87.01 | v31.02,86.38 32.66,86.38 C-03.1 | 33.04,89.03 33.04,94.45 PWR-TB2.4 | R-03.2 R-06.2 40.42,94.5 39.49,93.58 39.49,89.34
  Bottom 0.457: PWR-X3.3.4 5.75,72.53 6.13,72.91 6.13,74.34 6.25,74.46 6.25,78.56 6.89,79.2 v6.89,85.74 | v16.42,87.01 17.64,87.01 17.97,86.68 30.71,86.68 v31.02,86.38 31.02,79.39 36.73,73.68 v36.73,68.6 36.73,62.25 34.45,62.25 I2C-X.4
12V  (via drill 0.41)
  Top 0.457: J6.3 46.75,16.85 C-04.1 43.4,16.85 43.11,17.14 | IC-REG5.1 49.76,22.56 49.44,22.24 46.26,22.24 45.62,22.88 | 45.62,22.88 44.99,22.24 43.72,22.24 43.11,21.63 43.11,17.14 | 43.11,17.14 43.09,17.11 36.68,17.11 31.34,11.76 31.34,11.13 27.21,7 20.23,7 | 20.23,7 19.08,8.14 IC-MD01.8 | 20.23,7 12.26,7 M1/2-TB.4 7.69,11.57 M1/2-X.4 | M3/4-X.4 10.66,21.73 M3/4-TB.4 | M5-X.4 5.58,31.89 M5-TB.4 13.2,39.51 IC-MD02.8 | M7-X.4 5.75,52.21 6.89,53.36 11.63,53.36 M6-TB.4 | v62.13,34.31 62.13,41.84 63.02,42.73 63.02,49.27 62.11,50.18 62.11,56.57 REG-TB.3 | PWR-TB2.3 39.27,97.19 39.27,99.71 24.67,99.71 24.02,99.06 PWR-TB1.3 | JP0.2 45.62,22.88
  Bottom 0.457: 1.81,74.95 3.71,74.95 PWR-X3.3.3 | 6.89,87.65 3.97,87.65 PWR-XBUS.3 1.94,87.77 1.3,87.14 1.3,74.95 | 6.89,87.65 8.16,86.38 8.16,85.11 9.52,83.75 M8-TB.4 | 1.3,62.75 1.3,74.44 | 1.3,74.44 1.3,74.95 | 1.3,62.75 1.68,62.37 M8-X.4 6.69,62.37 10.96,66.64 10.96,67.75 M7-TB.4 13.88,68.51 15.23,69.87 18.96,69.87 IC-MD03.8 | 1.3,74.95 1.81,74.95 | 1.3,74.44 1.81,74.95 | J6.3 50.7,14.62 53.88,17.8 60.23,17.8 63.02,20.58 63.02,33.42 v62.13,34.31 | M5-X.4 1.94,31.89 1.25,31.2 | 1.25,12.72 1.25,20.34 | 1.25,20.34 1.25,31.2 | M1/2-X.4 2.39,11.57 1.25,12.72 | 1.25,20.34 2.64,21.73 M3/4-X.4 | 1.25,31.2 1.25,41.29 | 1.25,41.29 2.01,42.05 M6-X.4 7.4,42.05 11.42,38.03 M5-TB.4 | 1.25,41.29 1.25,51.45 | 1.25,51.45 2.01,52.21 M7-X.4 | 1.25,51.45 1.25,62.7 1.3,62.75 | 1.3,62.75 1.3,12.77 1.25,12.72 | 6.89,87.65 9.43,90.19 9.43,91.46 10.67,92.7 20.85,92.7 24.02,95.87 PWR-TB1.3
!E!
  Top 0.254: R-10.1 52.23,53.74 52.61,53.36 52.61,52.31 53.7,51.22 53.7,50.24 52.61,49.15 IC-MUX.6
CH_PD
  Top 0.254: IC-ESP.3 49.49,91.51 50.7,92.73 51.98,92.73 53.21,93.96 R-06.1
D+  (via drill 0.41)
  Top 0.254: IC-USB.3 47.53,36.84 v46.9,37.48 | v56.42,27.32 57.43,26.31 57.43,26.11 57.75,25.8 USB-X.D+
  Bottom 0.254: v46.9,37.48 47.53,36.85 50.3,36.85 52.52,34.62 53.41,34.62 55.23,32.8 55.23,29.63 55.53,29.32 55.53,28.21 v56.42,27.32
D-  (via drill 0.41)
  Top 0.254: IC-USB.4 47.66,36.34 v46.9,35.58 | USB-X.D- 57.32,25.15 v56.42,26.05
  Bottom 0.254: v46.9,35.58 47.53,36.21 50.29,36.21 52.33,34.17 53.22,34.17 54.77,32.61 54.77,29.44 55.07,29.13 55.07,27.8 55.25,27.63 55.25,27.21 55.6,26.86 55.61,26.86 v56.42,26.05
DTR  (via drill 0.41)
  Top 0.254: IC-USB.23 49.95,41.41 v49.44,41.93 | v55.79,53.36 55.15,53.99 55.15,56.53 53.37,58.31 v52.74,58.31 R-09.1 | v53.25,61.61 53.25,63.09 Q2.2
  Bottom 0.254: v49.44,41.93 50.17,42.66 55.89,42.66 57.18,43.96 57.18,48.37 55.86,49.69 55.86,53.28 v55.79,53.36 | v52.74,58.31 52.74,61.1 v53.25,61.61
EN
  Top 0.457: R-01.1 34.92,77.99 IC-REG3.3
GND  (via drill 0.41)
  Top 0.254: 51.98,32.53 C-01.2 | IC-USB.THERM 50.7,36.85 50.07,37.48 49.93,37.34 IC-USB.2 48.68,37.37 48.05,37.37 47.2,38.22 47.31,38.33 | C-05.2 49.76,28.28 50.7,27.33 v50.7,27.32 | IC-CHG.2 v51.34,4.46 | v48.8,2.56 48.04,3.32 R-12.2 | v36.1,3.19 37.37,4.46 37.37,7.13 X1.1 37.23,8.78 37.1,8.91 | RST-SW.A RST-SW.A' | 45.69,38.22 45.61,38.13 | IC-MUX.7 52.46,49.65 53.25,50.43 53.25,50.82 52.71,51.35 51.25,51.35 50.95,51.05 | IC-MUX.8 50.95,51.05 | 50.95,51.05 v50.95,52.09 49.86,53.19 R-10.2 | USB-X.SPRT@2 59.77,29.1 60.3,28.57
  Top 0.457: J6.2 55.24,19.42 USB-X.SPRT@1 59.63,22.5 60.12,22.99 | USB-X.SPRT@2 59.63,29.1 60.26,28.46 60.36,28.46 61.21,27.61 USB-X.BASE@2 USB-X.BASE@1 61.21,23.48 60.87,23.13 60.26,23.13 60.12,22.99 | J6.2 52.29,19.1 52.29,15.57 53.25,14.62 J6.1 | C-04.2 45.62,20.34 46.77,21.48 49.75,21.48 49.88,21.61 v50.7,21.61 | v50.7,21.61 51.98,20.34 J6.2 | IC-REG5.2 v50.7,21.61 | v42.45,10.81 38.01,10.81 37.1,9.91 37.1,8.91 | USB-X.GND 58.31,27.22 USB-X.SPRT@2 | v54.52,27.32 56.29,29.1 USB-X.SPRT@2 | 51.98,32.53 52.74,32.53 v53.25,33.04 57.69,37.48 SR-TB.1 | C-01.2 51.66,31.48 51.34,31.17 50.11,31.17 49.76,30.82 C-05.2 46.77,29.99 v45.62,31.13 | M1/2-TB.1 10.57,19.19 M1/2-X.1 1.3,19.19 1.18,19.07 | M1/2-TB.1 13.11,16.65 IC-MD01.5 | IC-MD01.5 26.58,16.65 | 26.58,16.65 IC-MD01.12 27.72,16.65 31.02,13.35 31.02,12.72 | M3/4-TB.1 7.78,29.35 M3/4-X.1 1.3,29.35 1.18,29.23 | 1.3,39.51 M5-X.1 6.38,39.51 8.79,41.93 8.79,47.01 10.32,48.53 M5-TB.1 17.94,48.53 | 1.3,39.51 1.18,39.39 1.18,29.23 | 1.18,29.23 1.18,19.07 | 1.18,19.07 1.18,10.81 3.08,8.91 7.53,8.91 11.33,5.1 26.58,5.1 v33.71,12.23 42.6,12.23 v43.72,13.35 44.04,13.67 C-08.2 | 1.3,39.51 1.18,39.64 1.18,48.91 | 1.18,48.91 1.18,59.07 | 1.18,59.07 1.18,69.23 | 1.18,69.23 1.18,76.85 | 1.18,76.85 1.18,79.39 | 1.18,79.39 1.18,81.93 | 1.18,81.93 1.18,83.84 | 1.18,83.84 2.57,85.23 PWR-XBUS.2 | PWR-XBUS.1 1.94,82.69 1.18,81.93 | PWR-X3.3.1 1.94,80.15 1.18,79.39 | 1.18,76.85 1.94,77.61 PWR-X3.3.2 7.02,77.61 7.21,77.8 | 1.18,69.23 1.94,69.99 M8-X.1 5.75,69.99 6.53,70.78 6.53,75.52 7.21,76.2 7.21,77.8 | M7-X.1 1.94,59.83 1.18,59.07 | IC-MD03.4 IC-MD03.5 | 15.14,79.01 M7-TB.1 8.41,79.01 7.21,77.8
  Top 0.457: 15.14,79.01 15.4,79.01 16.54,80.15 IC-MD03.4 | 15.14,79.01 16.54,77.61 IC-MD03.5 | IC-MD03.4 IC-MD03.13 IC-MD03.12 IC-MD03.5 | M6-X.1 1.94,49.67 1.18,48.91 | IC-MD01.4 IC-MD01.5 | 26.58,16.65 26.7,16.78 IC-MD01.13 IC-MD01.4 | IC-MD01.4 12.86,19.19 M1/2-TB.1 | IC-MD02.4 IC-MD02.13 IC-MD02.12 IC-MD02.5 | IC-MD02.5 IC-MD02.4 | IC-MD02.4 17.94,48.53 | IC-MD02.5 17.94,48.28 17.94,48.53 | 1.18,83.84 1.18,92.09 1.81,92.73 10.19,92.73 M8-TB.1 | 31.02,12.72 v29.12,10.81 | 31.02,12.72 42.36,24.05 M1-D.C M2-D.C M3-D.C v42.36,36.85 M4-D.C 44.86,38.88 44.99,38.75 C-06.2 | 45.69,38.22 C-06.2 | REG-TB.1 59.98,51.7 59.98,49.02 60.87,48.13 60.87,47.01 v60.23,46.37 56.55,46.37 v55.53,45.35 53.16,45.35 R-07.1 C-07.2 49.75,43.43 48.6,42.27 48.6,39.61 47.31,38.33 45.8,38.33 45.61,38.13 C-06.2 | M8-D.C 44.86,58.56 v46.9,56.53 | v42.45,52.72 42.45,51.04 M6-D.C | v42.45,48.91 42.45,47.23 M5-D.C | v42.45,56.53 42.45,54.85 M7-D.C | v34.83,88.28 34.94,88.17 C-03.2 C-02.2 34.94,82.45 35.47,81.93 36.1,81.93 36.73,81.3 36.73,80.03 | IC-REG3.2 34.07,76.09 v33.56,75.58 | IC-ESP.9 39.49,70.72 39.2,70.42 37.77,70.42 37.22,69.87 34.45,69.87 I2C-X.1 36.73,72.41 36.73,80.03 | RST-SW.A' 49.22,100.13 PWR-TB2.1 PWR-TB2.2 | IC-ESP.P$1 36.79,80.08 36.73,80.03 | USB-X.SPRT@4 61.11,29.38 60.3,28.57 | USB-X.SPRT@3 60.91,22.2 60.12,22.99
  Bottom 0.254: v50.7,27.32 v50.7,21.61 | v51.34,4.46 49.44,2.56 v48.8,2.56 36.73,2.56 v36.1,3.19 | v42.45,10.81 42.45,12.08 v43.72,13.35 | v50.95,52.09 47.53,52.09 47,52.62 47,56.43 v46.9,56.53
  Bottom 0.457: v42.45,10.81 51.16,10.81 J6.1 | v54.52,27.32 54.52,28.9 54.21,29.21 54.21,32.07 v53.25,33.04 | USB-X.SPRT@2 56.55,29.1 55.79,29.86 55.79,33.04 54.52,34.31 57.69,37.48 SR-TB.1 | M7-X.1 7.78,59.83 M6-TB.1 | v29.12,10.81 30.53,12.23 v33.71,12.23 38.79,12.23 41.81,15.26 41.81,24.15 42.43,24.76 42.62,24.76 45.65,27.79 45.65,29.39 45.62,29.42 v45.62,31.13 | v42.36,36.85 42.36,45.01 44.36,47.01 44.36,48.28 | 44.36,50.82 44.36,54.54 | 44.36,50.82 44.36,48.28 | 44.36,50.82 v42.45,52.72 | 44.36,48.28 43.09,48.28 v42.45,48.91 | 44.36,54.54 42.45,56.45 v42.45,56.53 | 44.36,54.54 44.36,54.63 46.26,56.53 v46.9,56.53 | PWR-TB1.2 PWR-TB1.1 | PWR-TB1.1 34.83,93.36 v34.83,88.28 | PWR-TB1.1 31.02,99.08 31.66,99.71 43.72,99.71 PWR-TB2.1 | v33.56,75.58 33.56,70.75 | 33.56,70.75 I2C-X.1 | IC-MD03.12 33.56,70.75
  pour Top (hatched): 4.35,3.83 8.16,0.02 55.4,0.02 59.47,4.08 63.41,8.02 63.41,10.18 63.41,93.61 59.47,97.55 55.53,101.49 55.28,101.49 8.03,101.49 4.1,97.55 0.03,93.49 0.03,8.14
GPIO0
  Top 0.254: Q2.3 52.36,66.31 51.98,66.69 49.94,66.69 47.5,69.13 46.59,69.13 46.16,69.56 46.16,70.47 45.49,71.14 IC-ESP.12
GPIO2
  Top 0.254: IC-MUX.9 50.45,50.82 50.2,51.07 49.19,51.07 48.8,51.45 48.8,54.63 49.05,54.88 51.34,54.88 51.55,55.09 R-05.1 51.55,56.95 51.34,57.17 49.36,57.17 46.9,59.63 46.9,65.43 44.18,68.15 44.18,69.42 43.49,70.11 IC-ESP.11
GPIO4/SDA  (via drill 0.41)
  Top 0.254: IC-ESP.13 47.49,70.46 v46.9,69.87 | v40.55,65.42 38.01,65.42 35.97,67.45 I2C-X.2
  Bottom 0.254: v40.55,65.42 41.8,65.42 46.19,69.8 46.83,69.8 v46.9,69.87
GPIO5/SCL  (via drill 0.41)
  Top 0.254: I2C-X.3 36.61,64.91 38.01,63.52 v40.55,63.52 | v49.44,69.87 49.44,72.57 IC-ESP.14
  Bottom 0.254: v49.44,69.87 47.94,69.87 47.2,69.13 46.16,69.13 v40.55,63.52
GPIO12/MISO  (via drill 0.41)
  Top 0.254: IC-MUX.11 48.16,49.15 47.85,49.47 47.85,56.74 44.99,59.59 44.99,65.4 43.7,66.69 v41.81,66.69 | IC-ESP.6 43.49,91.23 43.72,91.46 v44.36,91.46
  Bottom 0.254: v44.36,91.46 44.36,69.23 v41.81,66.69
GPIO13/MOSI  (via drill 0.41)
  Top 0.254: IC-MUX.10 48.8,49.65 48.3,50.15 48.3,56.93 45.62,59.61 45.62,65.41 43.26,67.77 43.26,67.78 v42.45,68.6 | IC-ESP.7 41.49,91.13 41.81,91.46 v42.45,91.46
  Bottom 0.254: v42.45,91.46 v42.45,68.6
GPIO14/SCK  (via drill 0.41)
  Top 0.254: v53.88,55.26 53.88,54.22 55.89,52.21 55.89,47.97 55.45,47.54 54.84,47.54 54.73,47.65 IC-MUX.3 | v46.26,91.46 45.62,91.46 45.49,91.32 IC-ESP.5
  Bottom 0.254: v46.26,91.46 52.15,85.56 52.15,69.68 54.86,66.97 54.87,66.97 v55.15,66.69 55.15,65.19 56.52,63.82 56.52,63.21 53.78,60.47 53.78,58.77 53.88,58.66 v53.88,55.26
GPIO15/TRIG  (via drill 0.41)
  Top 0.254: R-07.2 58.31,43.83 SR-TB.3 59.61,44.48 61.44,46.31 61.44,48.35 60.54,49.25 60.54,53.84 60.31,54.07 58.33,54.07 56.88,55.51 56.88,56.08 55.47,57.49 55.47,60.65 54.52,61.61 54.52,65.42 54.2,65.74 53.25,66.69 v53.25,67.33 | IC-ESP.10 41.49,70.18 v40.55,69.23
  Bottom 0.254: v40.55,69.23 40.55,66.69 39.27,65.42 39.27,63.74 40.24,62.78 43.62,62.78 49.44,68.6 51.98,68.6 v53.25,67.33
GPIO16/ECHO  (via drill 0.41)
  Top 0.254: v48.16,91.46 47.53,91.46 47.49,91.42 IC-ESP.4 | SR-TB.2 60.44,42.46 61.17,42.46 61.9,43.19 61.9,48.54 60.99,49.44 60.99,54.03 60.4,54.63 58.41,54.63 57.33,55.7 57.33,56.27 55.93,57.68 55.93,60.84 55.05,61.72 55.05,64.15 55.15,64.15 v57.05,66.06
  Bottom 0.254: v48.16,91.46 48.16,90.82 52.61,86.38 52.61,69.87 55.05,67.43 55.45,67.43 56.83,66.06 v57.05,66.06
M1-PWM  (via drill 0.41)
  Top 0.254: IC-MD01.2 18.19,24.27 17.05,25.42 17.05,29.83 18.36,31.13 30.39,31.13 34.07,27.45 M1-R.2 36.73,27.36 36.73,26.05 v37.37,25.42 | v45.62,43.83 45.62,44.69 45.52,44.8 45.52,46.26 47.42,48.15 IC-MUX.13
  Bottom 0.254: v37.37,25.42 38.61,25.42 38.71,25.31 42.38,25.31 45.09,28.02 45.09,29.16 44.89,29.36 44.89,31.44 45.32,31.87 45.7,31.87 45.7,34.31 45.7,37.97 45.73,38 45.73,43.73 v45.62,43.83
M1-Y
  Top 0.457: M1/2-X.3 8.65,14.11 M1/2-TB.3
  Bottom 0.457: IC-MD01.3 20.1,21.73 20.2,21.63 22.4,21.63 23.43,20.61 23.43,12.8 23.32,12.7 23.32,7.91 23.43,7.81 23.43,6.09 22.4,5.07 16.78,5.07 13.21,8.63 13.21,9.55 M1/2-TB.3
M2-PWM  (via drill 0.41)
  Top 0.254: v16.42,24.15 16.42,29.84 18.17,31.59 36.32,31.59 M2-R.2 36.65,29.95 v37.37,29.23 | v46.26,45.1 46.26,46.35 47.56,47.65 IC-MUX.14
  Bottom 0.254: v16.42,24.15 17.69,22.88 25.3,22.88 IC-MD01.15 | v37.37,29.23 37.73,28.87 37.73,26.94 38.9,25.77 42.19,25.77 44.63,28.21 44.63,28.97 44.43,29.17 44.43,31.62 45.24,32.44 45.24,38.16 45.27,38.19 45.27,43.14 44.89,43.53 44.89,44.14 45.32,44.57 45.73,44.57 v46.26,45.1
M2-Y
  Top 0.457: M1/2-X.2 9.61,16.65 M1/2-TB.2
  Bottom 0.457: M1/2-TB.2 10.06,12.9 10.06,6.81 11.14,5.73 15.04,5.73 16.46,4.31 22.72,4.31 24.19,5.78 24.19,8.12 24.09,8.22 24.09,12.38 24.19,12.48 24.19,21.12 24.8,21.73 IC-MD01.14
M3-PWM  (via drill 0.41)
  Top 0.254: v16.42,22.24 16.42,23.1 15.68,23.84 15.68,29.75 17.98,32.04 30.46,32.04 30.99,32.58 32.48,32.58 34.97,35.07 M3-R.2 36.65,33.76 v37.37,33.04 | v47.53,46.37 48.31,47.15 IC-MUX.15
  Bottom 0.254: v16.42,22.24 15.78,21.61 15.78,15.89 16.42,15.26 20.86,15.26 21.5,14.62 21.5,12.08 20.99,11.57 IC-MD01.7 | v37.37,33.04 38.18,32.22 38.18,27.13 39.09,26.23 42,26.23 44.18,28.4 44.18,28.78 43.97,28.98 43.97,31.81 44.79,32.63 44.79,38.35 44.81,38.38 44.81,42.96 44.43,43.34 44.43,44.32 45.94,45.84 47,45.84 v47.53,46.37
M3-Y
  Top 0.457: M3/4-X.3 8.16,24.27 9.94,26.05 11.48,26.05 M3/4-TB.3
  Bottom 0.457: IC-MD01.6 15.65,14.11 13.88,15.89 13.88,24.15 11.73,26.29 M3/4-TB.3
M4-PWM  (via drill 0.41)
  Top 0.254: v44.36,45.74 47.27,48.65 IC-MUX.12 | M4-R.2 36.65,37.57 v37.37,36.85 36.1,36.85 32.29,33.04 v29.75,33.04
  Bottom 0.254: v29.75,33.04 29.75,12.72 28.48,11.45 26.83,11.45 IC-MD01.10 | v37.37,36.85 38.64,35.58 38.64,27.32 39.27,26.69 41.81,26.69 43.72,28.59 43.52,28.79 43.52,32 44.33,32.82 44.33,38.54 44.36,38.57 44.36,42.77 43.97,43.15 43.97,44.51 44.36,44.9 v44.36,45.74
M4-Y
  Top 0.457: M3/4-X.2 8.74,26.81 M3/4-TB.2
  Bottom 0.457: M3/4-X.2 6.13,26.81 8.46,24.48 8.46,22.49 7.11,21.13 7.11,8.68 11.33,4.46 15.23,4.46 16.14,3.55 23.04,3.55 24.95,5.46 24.95,8.44 24.85,8.54 24.85,12.07 24.95,12.17 24.95,12.36 IC-MD01.11
M5-PWM  (via drill 0.41)
  Top 0.254: IC-MUX.1 50.95,46.12 51.47,45.61 v52.1,45.61 | M5-R.2 36.65,46.37 37.28,45.74 43.09,45.74 v46.26,48.91
  Top 0.457: M5-R.2 JP1.2
  Bottom 0.254: v52.1,45.61 50.96,44.47 49.44,44.47 48.8,45.1 48.8,46.99 46.88,48.91 v46.26,48.91
M5-PWM-A  (via drill 0.41)
  Top 0.254: JP1.3 30.71,47.95 v30.39,48.28
  Bottom 0.254: IC-MD02.2 21.5,54.75 22.89,53.36 27.85,53.36 30.39,50.82 v30.39,48.28
M5-PWM-B  (via drill 0.41)
  Top 0.254: JP1.1 32.34,46.32 v31.66,47.01
  Bottom 0.254: v31.66,47.01 31.66,50.82 27.72,54.75 IC-MD02.15
M5-Y-A  (via drill 0.41)
  Top 0.457: M5-X.3 5.75,34.43 11.33,40.02 11.72,40.4 | 11.72,40.4 M5-TB.3 | 11.72,40.4 16.42,45.1 v16.42,47.01
  Bottom 0.457: v16.42,47.01 16.42,49.55 IC-MD02.3
M5-Y-B
  Top 0.457: M5-X.2 5.75,36.97 10.06,41.29 10.06,43.83 11.26,45.03 M5-TB.2
  Bottom 0.457: M5-TB.2 14.1,47.41 14.1,49.82 17.69,53.41 21.5,53.41 22.69,52.21 IC-MD02.14
M6-PWM  (via drill 0.41)
  Top 0.254: IC-MUX.5 53.25,48.65 54.16,49.57 54.16,51.41 53.88,51.69 v53.88,52.09 | M6-R.2 36.65,50.27 37.37,49.55 42.04,49.55 42.15,49.65 42.76,49.65 42.86,49.55 44.99,49.55 v46.26,50.82
  Top 0.457: M6-R.2 JP2.2
  Bottom 0.254: v53.88,52.09 51.44,49.65 47.44,49.65 46.98,50.1 46.45,50.1 46.26,50.29 v46.26,50.82
M6-PWM-A
  Top 0.254: JP2.3 30.33,50.13 30.13,49.93 30.13,49.06 29.65,48.58 29.65,47.97 30.21,47.41 30.21,43.02 27.85,40.66 20.48,40.66 IC-MD02.7
M6-PWM-B
  Top 0.254: JP2.1 31.31,51.76 29.67,50.12 29.67,49.25 29.19,48.77 29.19,47.78 29.75,47.22 29.75,43.21 28.6,42.05 IC-MD02.10
M6-Y-A  (via drill 0.41)
  Top 0.457: v7.53,47.64 4.48,44.59 M6-X.3
  Bottom 0.457: M6-X.3 6.13,44.59 10.95,39.77 14.26,39.77 IC-MD02.6 | M6-TB.3 7.53,52.58 v7.53,47.64
M6-Y-B
  Top 0.457: M6-TB.2 13.88,58.11 13.88,52.09 12.6,50.82 8.79,50.82 5.11,47.13 M6-X.2
  Bottom 0.457: IC-MD02.11 22,44.59 20.86,45.74 16.42,45.74 13.88,43.2 9.43,43.2 5.49,47.13 M6-X.2
M7-PWM  (via drill 0.41)
  Top 0.254: IC-MUX.2 53.1,47.15 v53.88,46.37 | M7-R.2 36.65,54.08 37.37,53.36 42.04,53.36 42.15,53.46 42.76,53.46 42.86,53.36 v46.26,53.36
  Top 0.457: M7-R.2 JP3.2
  Bottom 0.254: v53.88,46.37 50.07,46.37 46.79,49.65 46.26,49.65 45.52,50.38 45.52,52.62 v46.26,53.36
M7-PWM-A  (via drill 0.41)
  Top 0.254: v16.42,81.3 16.42,82.57 IC-MD03.2 | v16.42,76.22 16.42,69.85 16.87,69.4 16.87,69.35 17.97,68.25 18.89,68.25 32.72,54.42 32.72,54.3 33.08,53.94 JP3.3
  Bottom 0.254: v16.42,76.22 v16.42,81.3
M7-PWM-B  (via drill 0.41)
  Top 0.254: JP3.1 32.62,55.57 v31.02,57.17 | IC-MD03.15 28.48,83.45 28.48,76.85 29.75,75.58 29.75,62.25 v31.02,60.98
  Bottom 0.254: v31.02,60.98 v31.02,57.17
M7-Y-A
  Top 0.457: M7-X.3 5.62,54.75 6.89,56.02 6.89,61.46 6.92,61.49 6.92,68.57 6.89,68.6 | M7-TB.3 8.4,72.01 7.86,71.47 7.86,70.2 6.89,69.23 6.89,68.6 | 6.89,68.6 6.89,68.36 6.92,68.34
  Bottom 0.457: IC-MD03.3 16.54,82.69 13.88,80.03 13.88,74.17 M7-TB.3
M7-Y-B
  Top 0.457: M7-X.2 3.97,57.17 5.62,57.17 6.23,57.78 6.23,61.74 6.25,61.76 6.25,68.06 6.23,68.09 6.23,69.54 7.2,70.5 7.2,72.41 10.37,75.58 11.64,75.58 M7-TB.2
  Bottom 0.457: IC-MD03.14 25.56,83.84 16.75,83.84 13.21,80.3 13.21,77.01 M7-TB.2
M8-PWM  (via drill 0.41)
  Top 0.254: v55.15,48.28 55.03,48.15 IC-MUX.4 | v46.26,55.26 46.26,55.9 44.89,57.27 42.15,57.27 42.04,57.17 37.37,57.17 36.65,57.89 M8-R.2
  Top 0.457: M8-R.2 JP4.2
  Bottom 0.254: v55.15,48.28 55.79,47.64 55.79,46.14 56.27,45.66 56.27,45.05 55.84,44.62 55.3,44.62 54.52,43.83 48.8,43.83 48.27,44.36 48.27,46.68 46.77,48.17 45.95,48.17 45.74,48.39 45.52,48.61 44.99,49.14 44.99,53.99 v46.26,55.26
M8-PWM-A
  Top 0.254: IC-MD03.7 18.96,72.41 17.69,72.41 17.05,71.77 17.05,69.87 17.33,69.59 17.33,69.54 18.16,68.71 19.08,68.71 26.18,61.61 27.62,61.61 31.48,57.75 JP4.3
M8-PWM-B
  Top 0.254: JP4.1 31.35,59.38 29.12,61.61 29.12,70.12 IC-MD03.10
M8-Y-A
  Bottom 0.457: IC-MD03.6 18.96,74.95 16.86,74.95 11.97,70.06 10.7,70.06 | M8-TB.3 11.72,86.06 12.67,86.06 14.03,84.71 14.03,82.79 12.6,81.37 12.6,81.3 11.22,81.3 9.43,79.51 9.43,71.4 10.17,70.66 | M8-X.3 8.15,64.91 10.17,66.93 10.17,69.87 | 10.17,69.87 10.17,70.66 | 10.17,69.87 10.36,70.06 10.7,70.06 | 10.17,70.66 10.7,70.13 10.7,70.06
M8-Y-B  (via drill 0.41)
  Top 0.457: v13.88,69.87 12.55,69.87 12.36,70.06 8.99,70.06 v8.79,69.87
  Bottom 0.457: IC-MD03.11 21.43,75.07 20.08,73.73 17.74,73.73 v13.88,69.87 | M8-TB.2 9.97,89.01 9.97,86.8 10.95,85.82 10.95,85.3 12.36,85.3 13.26,84.39 13.26,83.11 12.36,82.2 10.97,82.2 7.53,78.76 7.53,69.87 | v8.79,69.87 7.53,69.87 | 7.53,69.87 7.53,68.72 6.25,67.45 M8-X.2
N$1
  Top 0.254: R-11.1 52.03,1.32 CHG-D.C
N$2
  Top 0.457: M5-R.1 M5-D.A
N$3
  Top 0.254: R-11.2 50.32,5.63 IC-CHG.1
N$4
  Top 0.254: IC-CHG.5 50.39,9.22 50.07,9.54 48.16,9.54 48.04,9.41 R-12.1
N$5
  Top 0.457: M6-R.1 M6-D.A
N$6
  Top 0.254: M1-R.1 M1-D.A
N$7  (via drill 0.41)
  Top 0.254: IC-CHG.3 52.61,5.38 v52.61,4.46 | v48.16,1.29 47.28,2.17 JP5.1
  Bottom 0.254: v52.61,4.46 49.44,1.29 v48.16,1.29
N$8
  Top 0.254: IC-USB.6 47.7,35.34 | 47.7,35.34 47.2,34.84 45.73,34.84 44.99,35.58 C-06.1 | IC-USB.5 48.2,35.84 47.7,35.34
N$9
  Top 0.254: M2-R.1 40.42,31.26
  Top 0.457: M2-D.A 40.42,31.26
N$10
  Top 0.254: IC-REG5.3 51.66,22.56 51.98,22.24 53.25,22.24 53.5,22.49 R-02.1
N$11
  Top 0.457: M7-R.1 M7-D.A
N$12
  Top 0.254: Q1.1 48.23,59 48.93,58.31 R-09.2
N$13
  Top 0.254: Q2.1 51.41,60.74 R-08.2
N$15
  Top 0.457: M8-R.1 M8-D.A
N$18
  Top 0.254: M3-R.1 M3-D.A
N$19
  Top 0.254: M4-R.1 M4-D.A
N$21
  Top 0.254: C-05.1 IC-REG5.4
REG-EN  (via drill 0.41)
  Top 0.254: JP0.1 47.76,27.32 v48.8,27.32 | R-02.2 53.5,26.43 v52.61,27.32 52.61,30.5 56.45,34.33 60.89,34.33 61.48,34.92 61.48,42.12 62.36,43 62.36,48.73 61.45,49.63 61.45,55.31 60.54,56.22 REG-TB.2
  Bottom 0.254: v52.61,27.32 51.87,28.06 49.64,28.06 49.62,28.03 49.51,28.03 v48.8,27.32
RESET  (via drill 0.41)
  Top 0.254: 53.25,98.44 53.25,96.45 R-03.1 54.01,96.41 55.15,95.27 55.15,93.36 v53.49,91.7 IC-ESP.1 | 53.25,98.44 53.33,98.53 RST-SW.B | 53.25,98.44 53.16,98.53 RST-SW.B' | Q1.3 47.53,66.9 v47.53,67.96
  Bottom 0.254: v53.49,91.7 51.73,91.7 51.24,92.19 45.95,92.19 45.52,91.76 45.52,91.15 45.62,91.05 45.62,90.82 51.7,84.75 51.7,69.87 50.48,69.87 49.74,69.13 48.7,69.13 v47.53,67.96
RTS  (via drill 0.41)
  Top 0.254: IC-USB.19 51.95,39.37 53.25,40.66 53.88,40.66 v55.15,41.93 | Q1.2 50.13,62.31 49.86,62.03 R-08.1 49.86,59.92 50.32,59.45 52.86,59.45 53.25,59.07 v54.52,59.07
  Bottom 0.254: v55.15,41.93 55.43,42.2 56.08,42.2 56.89,43.02 60.06,43.02 60.13,42.95 60.13,42.89 60.56,42.46 61.41,42.46 62.13,43.18 62.13,47.01 59.7,49.44 56.75,49.44 56.32,49.88 56.32,50.49 56.52,50.69 56.52,57.06 v54.52,59.07
RXD
  Top 0.254: IC-ESP.15 51.49,70.98 53.88,68.6 R-04.2
TXD  (via drill 0.41)
  Top 0.254: IC-USB.20 51.45,40.14 v53.25,41.93 | IC-ESP.16 53.49,70.75 54.37,69.87 59.61,69.87 61.32,68.15 61.32,68.14 v62.77,66.69
  Bottom 0.254: v53.25,41.93 54.11,41.93 54.84,41.19 55.71,41.19 57.08,42.56 59.81,42.56 60.37,42 61.6,42 62.59,42.99 62.59,44.9 62.77,45.08 v62.77,66.69
USB_RX  (via drill 0.41)
  Top 0.254: IC-USB.21 50.95,41.54 v51.34,41.93 | R-04.1 60.23,68.6 60.87,67.96 v60.87,66.69 60.87,65.42 60.23,64.79 57.05,64.79 v55.79,63.52
  Bottom 0.254: v51.34,41.93 50.7,41.93 49.75,40.97 49.12,40.97 48.7,41.39 48.7,42.46 49.44,43.2 54.53,43.2 55.49,44.16 56.02,44.16 56.73,44.86 56.73,45.85 56.42,46.15 56.42,48.48 55.4,49.5 55.4,51.83 51.98,55.26 51.98,62.88 52.61,63.52 v55.79,63.52
VBAT  (via drill 0.41)
  Top 0.254: D-01.A 44.86,4.13 JP5.2 43.34,2.17 | v37.37,1.29 36.73,1.29 35.23,2.79 X1.2 35.23,9.94 36.96,11.67 45.4,11.67 | v42.45,1.29 43.34,2.17 | 45.4,11.67 43.34,9.61 43.34,2.17 | 45.4,11.67 C-08.1
  Bottom 0.254: v37.37,1.29 v42.45,1.29
VBUS  (via drill 0.41)
  Top 0.254: IC-USB.8 49.95,32.73 C-01.1 | IC-USB.7 49.45,32.83 C-01.1 | C-01.1 49.63,32.4 47.96,32.4 47.43,31.87 v47.53,31.77 | CHG-D.A 53.28,3.22 54.52,4.46 v54.52,10.18 | IC-CHG.4 52.29,9.22 53.25,10.18 | v54.52,10.18 62.13,10.18 62.77,10.81 62.77,13.99 v57.05,19.7 | v46.9,39.39 47.85,40.34 29.43,40.34 | D-01.C 45.75,9.67 46.26,10.18 53.25,10.18 | 53.25,10.18 v54.52,10.18 | IC-MUX.EP 50.45,48.15 IC-MUX.16 50.45,46.12 50.07,45.74 48.16,45.74 47.85,45.42 C-07.1 | v53.88,39.39 57.05,42.56 59.89,42.56 60.53,43.2 v60.87,43.2 | v57.05,50.18 58.96,48.28 SR-TB.4 | v47.53,28.59 48.57,28.59 49.76,27.41 IC-REG5.5
  Top 0.457: USB-X.VBUS 56.7,24.5 v56.42,24.78 | IC-MD03.1 IC-MD03.16 28.79,87.77 30.18,86.38 30.18,86.03 30.39,85.83 30.39,77.49 | v14.51,26.69 12.16,24.34 10.26,24.34 8.79,22.88 v7.53,22.88 | v23.4,41.93 24.67,43.2 28.48,43.2 29.12,43.83 29.12,47.07 28.63,47.55 28.63,49 29.12,49.48 29.12,56.23 28.05,57.29 IC-MD02.16 | IC-MD02.9 28.61,39.51 29.43,40.34 29.44,40.34 47.85,40.34 | 47.85,40.34 | 47.85,40.34 C-07.1 | PWR-TB1.4 19.08,95.73 IC-MD03.1 | PWR-XBUS.4 8.92,90.31 11.33,92.73 14.13,92.73 IC-MD03.1 | 30.39,77.49 30.39,75.58 31.02,74.95 | 31.02,74.95 32.29,73.68 R-01.2 | 30.39,77.49 31.66,76.22 32.93,76.22 33.12,76.41 IC-REG3.1 | v31.02,71.14 31.02,74.95
  Bottom 0.254: v57.05,19.7 57.05,24.15 v56.42,24.78 | v47.53,31.77 46.16,33.14 46.16,37.79 46.18,37.81 46.18,39.31 46.26,39.39 v46.9,39.39 v53.88,39.39 | v60.87,43.2 61.5,43.2 61.5,46.99 60.51,47.98 SR-TB.4 | REG-TB.4 57.05,61.32 v57.05,50.18
  Bottom 0.457: PWR-XBUS.4 3.71,90.19 1.81,90.19 0.48,88.86 0.48,10.87 2.44,8.91 5.81,8.91 6.35,8.37 | 27.21,4.46 31.66,4.46 38.76,11.57 39.06,11.57 42.48,14.98 42.48,23.87 42.7,24.09 42.89,24.09 47.38,28.59 v47.53,28.59 | IC-MD01.9 26.7,4.97 27.21,4.46 | 6.35,8.37 11.02,3.7 14.91,3.7 15.83,2.78 23.35,2.78 25.03,4.46 27.21,4.46 | 6.35,8.37 6.35,21.7 v7.53,22.88 | v14.51,26.69 14.64,26.81 IC-MD01.1 IC-MD01.16 IC-MD02.9 24.54,39.51 23.4,40.66 v23.4,41.93 | IC-MD02.1 IC-MD02.16 | v47.53,31.77 v47.53,28.59 | v47.53,28.59 47.55,28.62 52.5,28.62 53.68,27.44 53.68,26.97 55.87,24.78 v56.42,24.78 | IC-MD03.9 29.88,69.99 v31.02,71.14

### Text on the board
tSilk: Edward Daniel Nichols - BART / University of Central Florida SPG2020